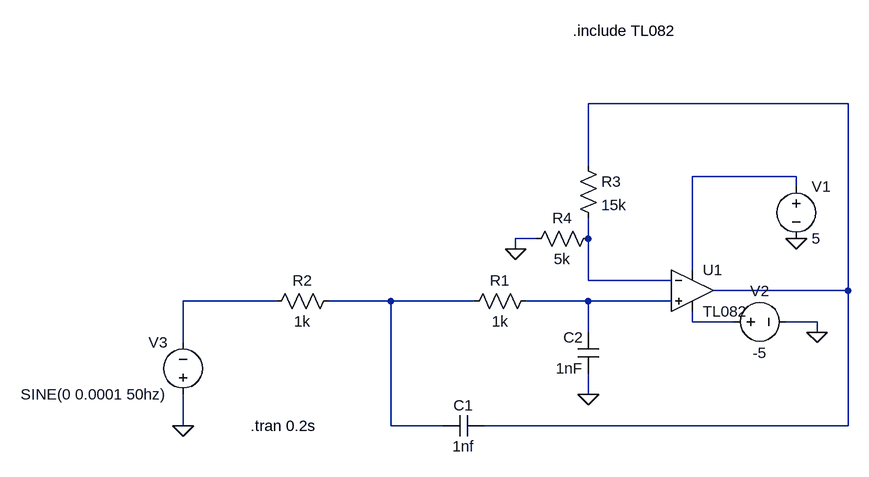
[diagram p0: schematic PasoBajo.asc]
PasoBajo.asc, the LTspice schematic file:
Version 4
SHEET 1 1044 948
WIRE 912 -176 512 -176
WIRE 512 -80 512 -176
WIRE 832 -64 672 -64
WIRE 832 -48 832 -64
WIRE 432 32 400 32
WIRE 512 32 512 0
WIRE 400 48 400 32
WIRE 672 80 672 -64
WIRE 512 96 512 32
WIRE 640 96 512 96
WIRE 912 112 912 -176
WIRE 912 112 704 112
WIRE 32 128 -112 128
WIRE 208 128 112 128
WIRE 336 128 208 128
WIRE 512 128 416 128
WIRE 640 128 512 128
WIRE 672 160 672 144
WIRE 736 160 672 160
WIRE 864 160 816 160
WIRE 512 176 512 128
WIRE 864 176 864 160
WIRE -112 192 -112 128
WIRE 512 272 512 240
WIRE -112 320 -112 272
WIRE 208 320 208 128
WIRE 288 320 208 320
WIRE 912 320 912 112
WIRE 912 320 352 320
FLAG -112 320 0
FLAG 832 32 0
FLAG 864 176 0
FLAG 512 272 0
FLAG 400 48 0
SYMBOL voltage -112 288 R180
WINDOW 0 24 96 Left 2
WINDOW 3 24 16 Left 2
WINDOW 123 24 -12 Left 2
WINDOW 39 0 0 Left 2
SYMATTR InstName V3
SYMATTR Value SINE(0 0.0001 50hz)
SYMBOL voltage 832 -64 R0
WINDOW 123 0 0 Left 2
WINDOW 39 0 0 Left 2
SYMATTR InstName V1
SYMATTR Value 5
SYMBOL voltage 720 160 R270
WINDOW 0 32 56 VTop 2
WINDOW 3 -32 56 VBottom 2
WINDOW 123 0 0 Left 2
WINDOW 39 0 0 Left 2
SYMATTR InstName V2
SYMATTR Value -5
SYMBOL Opamps\\opamp2 672 48 R0
SYMATTR InstName U1
SYMATTR Value TL082
SYMBOL cap 352 304 R90
WINDOW 0 0 32 VBottom 2
WINDOW 3 32 32 VTop 2
SYMATTR InstName C1
SYMATTR Value 1nf
SYMBOL cap 528 240 R180
WINDOW 0 24 56 Left 2
WINDOW 3 24 8 Left 2
SYMATTR InstName C2
SYMATTR Value 1nF
SYMBOL res 432 112 R90
WINDOW 0 0 56 VBottom 2
WINDOW 3 32 56 VTop 2
SYMATTR InstName R1
SYMATTR Value 1k
SYMBOL res 128 112 R90
WINDOW 0 0 56 VBottom 2
WINDOW 3 32 56 VTop 2
SYMATTR InstName R2
SYMATTR Value 1k
SYMBOL res 496 -96 R0
SYMATTR InstName R3
SYMATTR Value 15k
SYMBOL res 528 16 R90
WINDOW 0 0 56 VBottom 2
WINDOW 3 32 56 VTop 2
SYMATTR InstName R4
SYMATTR Value 5k
TEXT 488 -288 Left 2 !.include TL082
TEXT -8 320 Left 2 !.tran 0.2s

The netlist it stands for:
* PasoBajo.asc
V3 0 N004 SINE(0 0.0001 50hz)
V1 N002 0 5
V2 N007 0 -5
XU1 N006 N003 N002 N007 N001 TL082  ; pins In+ In- V+ V- OUT
C1 N001 N005 1nf
C2 0 N006 1nF
R1 N006 N005 1k
R2 N005 N004 1k
R3 N001 N003 15k
R4 N003 0 5k
.include TL082
.tran 0.2s
.backanno
.end